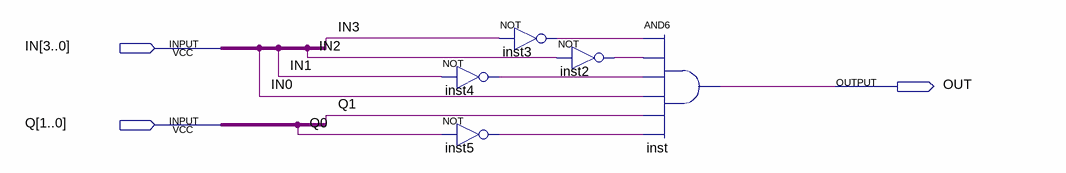
[diagram p0: schematic sheet]
// Quartus schematic Mealy-Decode.bdf as structural Verilog: 5 symbols, 3 pins
module \Mealy-Decode  (
  input  [3:0] IN,
  input  [1:0] Q,
  output OUT
);

  wire inst2_out, inst3_out, inst4_out, inst5_out;

  not inst4 (inst4_out, IN[1]);
  not inst5 (inst5_out, Q[0]);
  not inst3 (inst3_out, IN[3]);
  not inst2 (inst2_out, IN[2]);
  and inst (OUT, inst3_out, inst2_out, inst4_out, IN[0], Q[1], inst5_out);
endmodule
